# EAGLE schematic Comunication_Board_RoboFEI-HT (EAGLE 9.7.0)
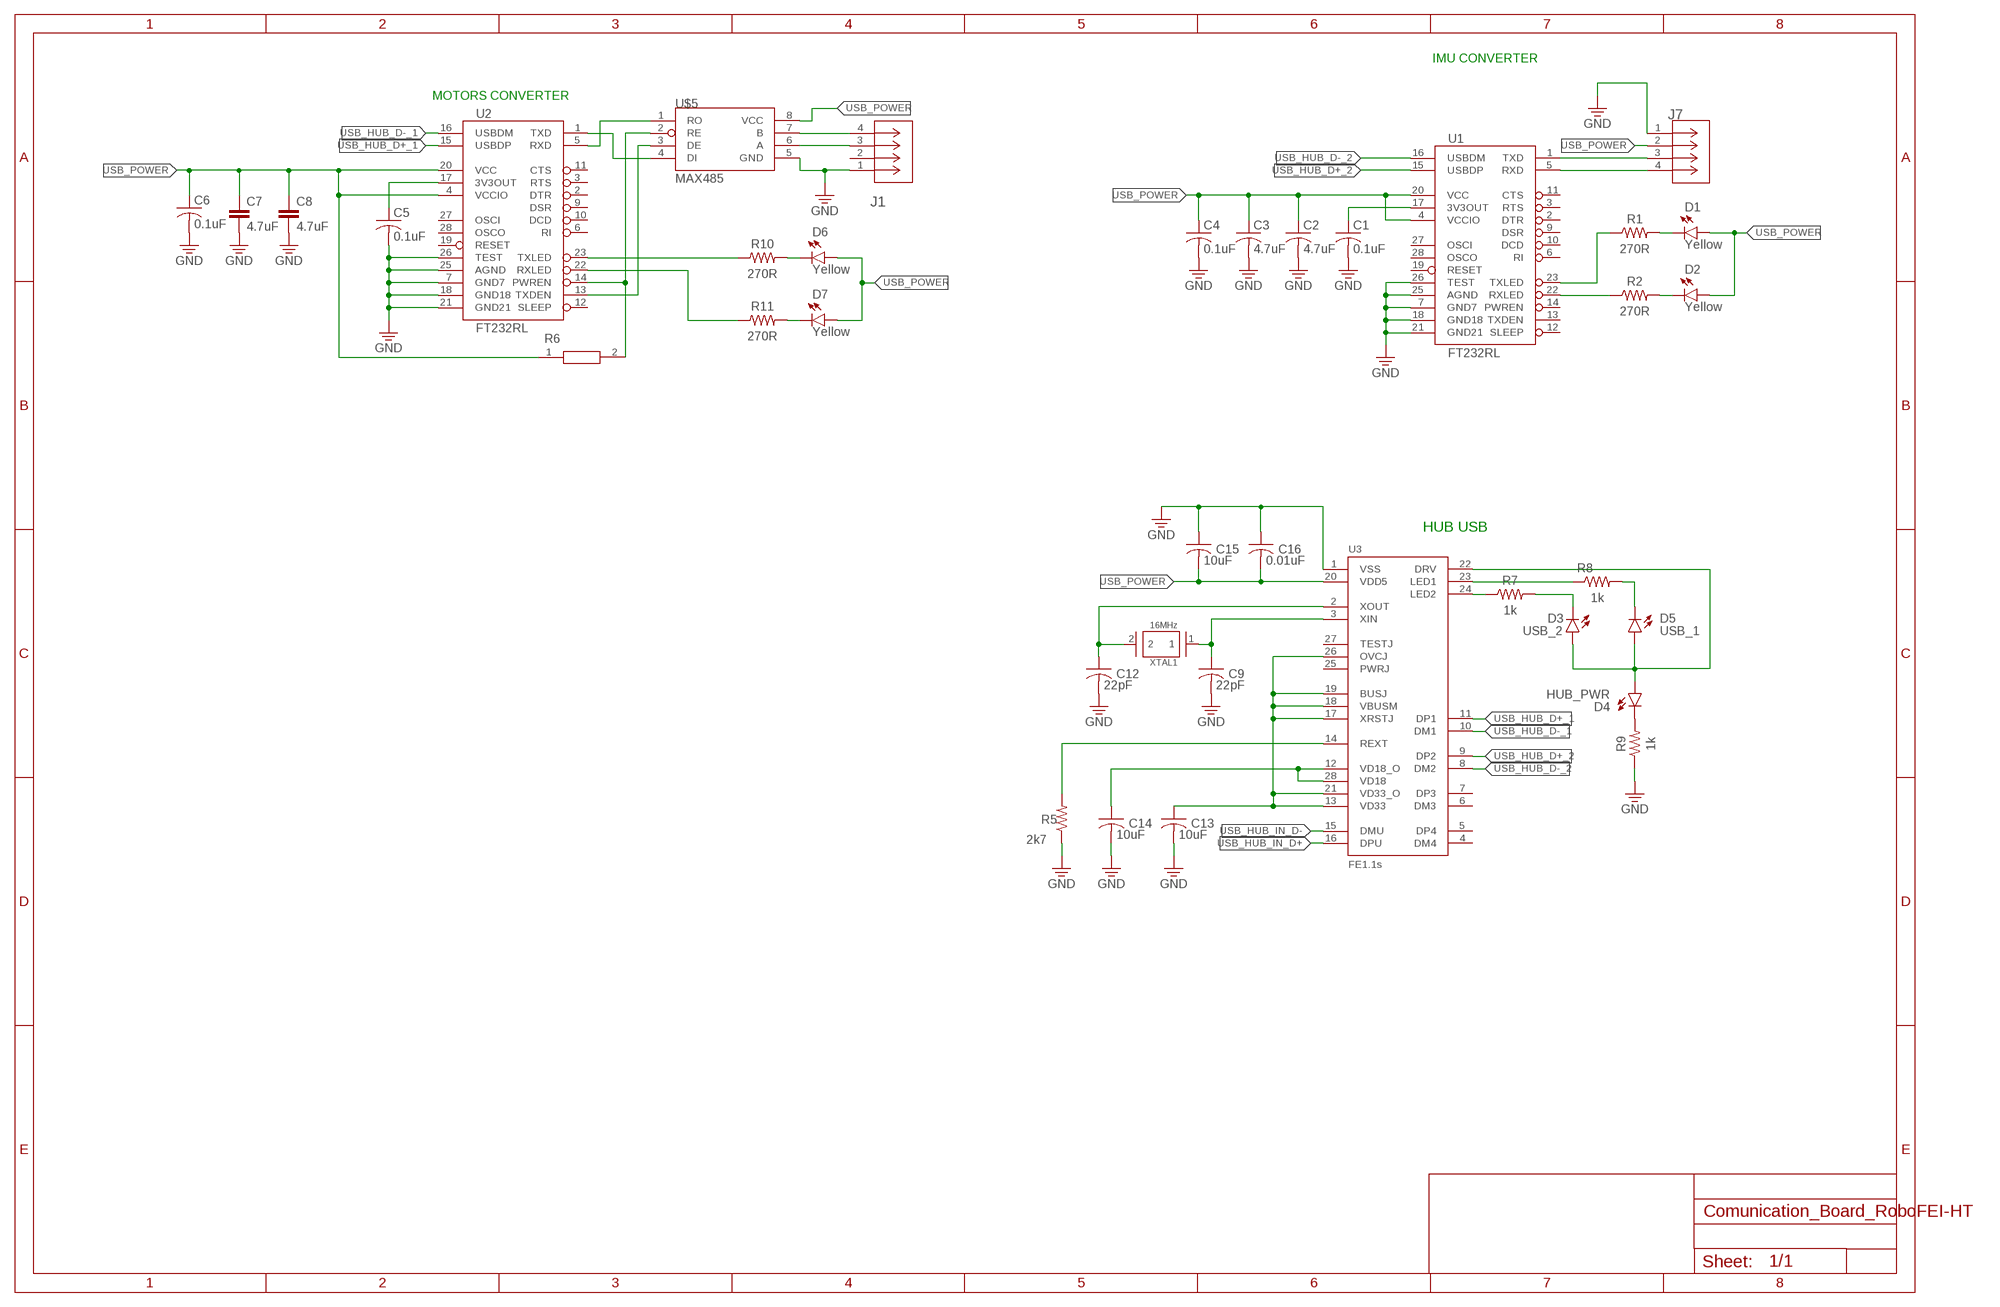
[diagram p0: schematic, sheet 1]

## Parts
C1  0.1uF  C-US_CHIP-1206(3216-METRIC)  [CAPC3216X135]
C2  4.7uF  C-US_CHIP-1206(3216-METRIC)  [CAPC3216X135]
C3  4.7uF  C-US_CHIP-1206(3216-METRIC)  [CAPC3216X135]
C4  0.1uF  C-US_CHIP-1206(3216-METRIC)  [CAPC3216X135]
C5  0.1uF  C-US_CHIP-1206(3216-METRIC)  [CAPC3216X135]
C6  0.1uF  C-US_CHIP-1206(3216-METRIC)  [CAPC3216X135]
C7  4.7uF  4.7UF-1206-16V-(+80/-20%)  [1206]
C8  4.7uF  4.7UF-1206-16V-(+80/-20%)  [1206]
C9  22pF  C-US_CHIP-1206(3216-METRIC)  [CAPC3216X135]
C12  22pF  C-US_CHIP-1206(3216-METRIC)  [CAPC3216X135]
C13  10uF  C-US_CHIP-1206(3216-METRIC)  [CAPC3216X135]
C14  10uF  C-US_CHIP-1206(3216-METRIC)  [CAPC3216X135]
C15  10uF  C-US_CHIP-1206(3216-METRIC)  [CAPC3216X135]
C16  0.01uF  C-US_CHIP-1206(3216-METRIC)  [CAPC3216X135]
D1  Yellow  CHIP-FLAT-Y_1206  [LEDC3216X75N_FLAT-Y]
D2  Yellow  CHIP-FLAT-Y_1206  [LEDC3216X75N_FLAT-Y]
D3  USB_2  CHIP-FLAT-Y_1206  [LEDC3216X75N_FLAT-Y]
D4  HUB_PWR  CHIP-FLAT-Y_1206  [LEDC3216X75N_FLAT-Y]
D5  USB_1  CHIP-FLAT-Y_1206  [LEDC3216X75N_FLAT-Y]
D6  Yellow  CHIP-FLAT-Y_1206  [LEDC3216X75N_FLAT-Y]
D7  Yellow  CHIP-FLAT-Y_1206  [LEDC3216X75N_FLAT-Y]
J1  2074790004CON_2074790004_MOL  [CON_2074790004_MOL]
J7  IMU  JST_B4B-EH-ACONN_B4B-EH-A_JST  [JST_B4B-EH-A]
R1  270R  R-US_CHIP-1206(3216-METRIC)  [RESC3216X70]
R2  270R  R-US_CHIP-1206(3216-METRIC)  [RESC3216X70]
R5  2k7  R-US_CHIP-1206(3216-METRIC)  [RESC3216X70]
R6  RA73F2A10KBTDF  [RESC2012X58N]
R7  1k  R-US_CHIP-1206(3216-METRIC)  [RESC3216X70]
R8  1k  R-US_CHIP-1206(3216-METRIC)  [RESC3216X70]
R9  1k  R-US_CHIP-1206(3216-METRIC)  [RESC3216X70]
R10  270R  R-US_CHIP-1206(3216-METRIC)  [RESC3216X70]
R11  270R  R-US_CHIP-1206(3216-METRIC)  [RESC3216X70]
U1  FT232RL  FT232RLFT232SSOP28  [SSOP28]
U2  FT232RL  FT232RLSSOP  [SSOP28DB]
U3  FE1.1S  [FE1.1S_SSOP-28]
U$5  MAX485  [SO08]
XTAL1  16MHz  ABLS  [XTAL1147X477X420N]

## Nets
GND: C1.2 C2.2 C3.2 C4.2 C6.2 C7.2 C8.2 C9.2 C12.2 C13.2 C14.2 C15.1 C16.1 J1.1 J7.1 R5.1 R9.1 U1.7(GND7) U1.18(GND18) U1.21(GND21) U1.25(AGND) U1.26(TEST) U3.1(VSS) U$5.5(GND)
N$2: R2.1 U1.22(RXLED)
N$3: R7.1 U3.24(LED2)
N$4: U2.1(TXD) U$5.4(DI)
N$5: C1.1 U1.17(3V3OUT)
N$6: D3.C R7.2
N$7: J7.3 U1.1(TXD)
N$8: J7.4 U1.5(RXD)
N$9: U2.5(RXD) U$5.1(RO)
N$10: R6.2 U2.14(PWREN) U$5.2(RE)
N$11: U2.13(TXDEN) U$5.3(DE)
N$12: R8.1 U3.23(LED1)
N$13: C5.1 U2.17(3V3OUT)
N$14: J1.3 U$5.6(A)
N$15: D5.C R8.2
N$16: C9.1 U3.3(XIN) XTAL1.1
N$17: D2.C R2.2
N$18: R1.1 U1.23(TXLED)
N$19: D1.C R1.2
N$20: R10.1 U2.23(TXLED)
N$21: C13.1 U3.13(VD33) U3.17(XRSTJ) U3.18(VBUSM) U3.19(BUSJ) U3.21(VD33_O) U3.26(OVCJ)
N$23: R5.2 U3.14(REXT)
N$24: C12.1 U3.2(XOUT) XTAL1.2
N$25: D3.A D4.A D5.A U3.22(DRV)
N$26: D4.C R9.2
N$27: J1.4 U$5.7(B)
N$28: C14.1 U3.12(VD18_O) U3.28(VD18)
N$29: C5.2 U2.7(GND7) U2.18(GND18) U2.21(GND21) U2.25(AGND) U2.26(TEST) ; supply symbol labelled GND
N$31: D7.C R11.2
N$32: D6.C R10.2
N$33: R11.1 U2.22(RXLED)
USB_HUB_D+_1: U2.15(USBDP) U3.11(DP1)
USB_HUB_D+_2: U1.15(USBDP) U3.9(DP2)
USB_HUB_D-_1: U2.16(USBDM) U3.10(DM1)
USB_HUB_D-_2: U1.16(USBDM) U3.8(DM2)
USB_HUB_IN_D+: U3.16(DPU)
USB_HUB_IN_D-: U3.15(DMU)
USB_POWER: C2.1 C3.1 C4.1 C6.1 C7.1 C8.1 C15.2 C16.2 D1.A D2.A D6.A D7.A J7.2 R6.1 U1.4(VCCIO) U1.20(VCC) U2.4(VCCIO) U2.20(VCC) U3.20(VDD5) U$5.8(VCC)
Unconnected: J1.2 U1.2(DTR) U1.3(RTS) U1.6(RI) U1.9(DSR) U1.10(DCD) U1.11(CTS) U1.12(SLEEP) U1.13(TXDEN) U1.14(PWREN) U1.19(RESET) U1.27(OSCI) U1.28(OSCO) U2.2(DTR) U2.3(RTS) U2.6(RI) U2.9(DSR) U2.10(DCD) U2.11(CTS) U2.12(SLEEP) U2.19(RESET) U2.27(OSCI) U2.28(OSCO) U3.4(DM4) U3.5(DP4) U3.6(DM3) U3.7(DP3) U3.25(PWRJ) U3.27(TESTJ)

## Notes on the sheet
- IMU CONVERTER
- MOTORS CONVERTER
- HUB USB

## Library data of the parts
C1-C6 C9 C12-C16 = Capacitor:C-US: Capacitor - ANSI; CATEGORY: Capacitor
C7 C8 = SparkFun-Capacitors:4.7UF: 4.7µF ceramic capacitors A capacitor is a passive two-terminal electrical component used to store electrical energy temporarily in an electric field.; PROD_ID: CAP-10300
D1-D7 = LED:CHIP-FLAT-Y; CATEGORY: LED; COLOR: YELLOW; DESCRIPTION: CHIP LED FLAT; SUB-CATEGORY: CHIP; TYPE: FLAT_TOP; VALUE: LED_YELLOW
J1 = molex:2074790004; COPYRIGHT: Copyright (C) 2023 Ultra Librarian. All rights reserved.; MANUFACTURER_PART_NUMBER: 2074790004; MFR_NAME: Molex Connector Corporation
J7 = RoboFEI Humanoide - 2023:JST_B4B-EH-A; COPYRIGHT: Copyright (C) 2023 Ultra Librarian. All rights reserved.; MANUFACTURER_PART_NUMBER: B4B-EH-A(LF)(SN); MFR_NAME: JST
R1 R2 R5 R7-R11 = Resistor:R-US: Resistor Fixed - ANSI; CATEGORY: Resistor; SUB-CATEGORY: Fixed
R6 = RA73F2A10KBTDF:RA73F2A10KBTDF: Thin Film Resistors - SMD RA73F 2A 10K 0.1% 1K RL Source: Datasheet <https://www.mouser.in/datasheet/2/418/8/ENG_DS_1773270_3_A-2899722.pdf>; DESCRIPTION: Thin Film Resistors - SMD RA73F 2A 10K 0.1% 1K RL; HEIGHT: 0.58mm; MANUFACTURER_NAME: TE Connectivity; MANUFACTURER_PART_NUMBER: RA73F2A10KBTDF; MOUSER_PART_NUMBER: 279-RA73F2A10KBTDF; MOUSER_PRICE-STOCK: https://www.mouser.co.uk/ProductDetail/TE-Connectivity-Holsworthy/RA73F2A10KBTDF?qs=Li%252BoUPsLEntqleNaLrqoUg%3D%3D
U1 = RoboFEI Humanoide - 2023:FT232RL: FT232RL USB UART FT232RL 4th Generation USB UART (USB <-> Serial) Controller. Datasheet <http://www.sparkfun.com/datasheets/IC/FT232R_v104.pdf> SparkFun Products Component <https://www.sparkfun.com/products/650> (COM-00650) SparkFun RedBot Mainboard <https://www.sparkfun.com/products/12097> (ROB-12097) SparkFun FTDI Basic Breakout - 5V <https://www.sparkfun.com/products/9716> (DEV-09716) SparkFun FTDI Basic Breakout - 3.3V <https://www.sparkfun.com/products/9873> (DEV-09873) Bus Pirate - v3.6a <https://www.sparkfun.com/products/12942> (TOL-12942) SparkFun USB to Serial Breakout - FT232RL <https://www.sparkfun.com/products/12731> (BOB-12731) SparkFun PicoBoard <https://www.sparkfun.com/products/11888> (WIG-11888) SparkFun RFID USB Reader <https://www.sparkfun.com/products/9963> (SEN-09963) LilyPad FTDI Basic Breakout - 5V <https://www.sparkfun.com/products/10275> (DEV-10275) SparkFun Stepoko <https://www.sparkfun.com/products/13899> (ROB-13899)
U2 = SparkFun-IC-Comms:FT232RL: FT232RL USB UART FT232RL 4th Generation USB UART (USB <-> Serial) Controller. Datasheet <http://www.sparkfun.com/datasheets/IC/FT232R_v104.pdf> SparkFun Products Component <https://www.sparkfun.com/products/650> (COM-00650) SparkFun RedBot Mainboard <https://www.sparkfun.com/products/12097> (ROB-12097) SparkFun FTDI Basic Breakout - 5V <https://www.sparkfun.com/products/9716> (DEV-09716) SparkFun FTDI Basic Breakout - 3.3V <https://www.sparkfun.com/products/9873> (DEV-09873) Bus Pirate - v3.6a <https://www.sparkfun.com/products/12942> (TOL-12942) SparkFun USB to Serial Breakout - FT232RL <https://www.sparkfun.com/products/12731> (BOB-12731) SparkFun PicoBoard <https://www.sparkfun.com/products/11888> (WIG-11888) SparkFun RFID USB Reader <https://www.sparkfun.com/products/9963> (SEN-09963) LilyPad FTDI Basic Breakout - 5V <https://www.sparkfun.com/products/10275> (DEV-10275) SparkFun Stepoko <https://www.sparkfun.com/products/13899> (ROB-13899); PROD_ID: IC-00870
U3 = FE1.1S:FE1.1S
U$5 = MAX485 (1):MAX485
XTAL1 = Frequency-Source:ABLS: HC/49US (AT49) SMD LOW PROFILE CRYSTAL Datasheet <https://abracon.com/Resonators/abls.pdf>; CATEGORY: HC/49US (AT49) SMD LOW PROFILE CRYSTAL; DESCRIPTION: Crystal 16MHZ SMD 11.5 x 4.7 x 4.2 mm; FREQUENCY: 16MHZ; MANUFACTURER: ABRACON; MPN: ABLS-16.000MHZ-S-R500MD2XF; OPERATING_TEMPERATURE: -40°C ~ +85°C; PART_STATUS: ACTIVE; ROHS_COMPLIANT: COMPLIANT; SERIES: ABLS; SUB_CATEGORY: Crystal; TOLERANCE: 20PPM; TYPE: Low Profile Crystal